# Altium project dashcam_cpu_v2.0.PrjPcb (part 10 of 13)

## Sheet wifi_ble.SchDoc
size A2; SheetNumber: 12; SheetTotal: 15
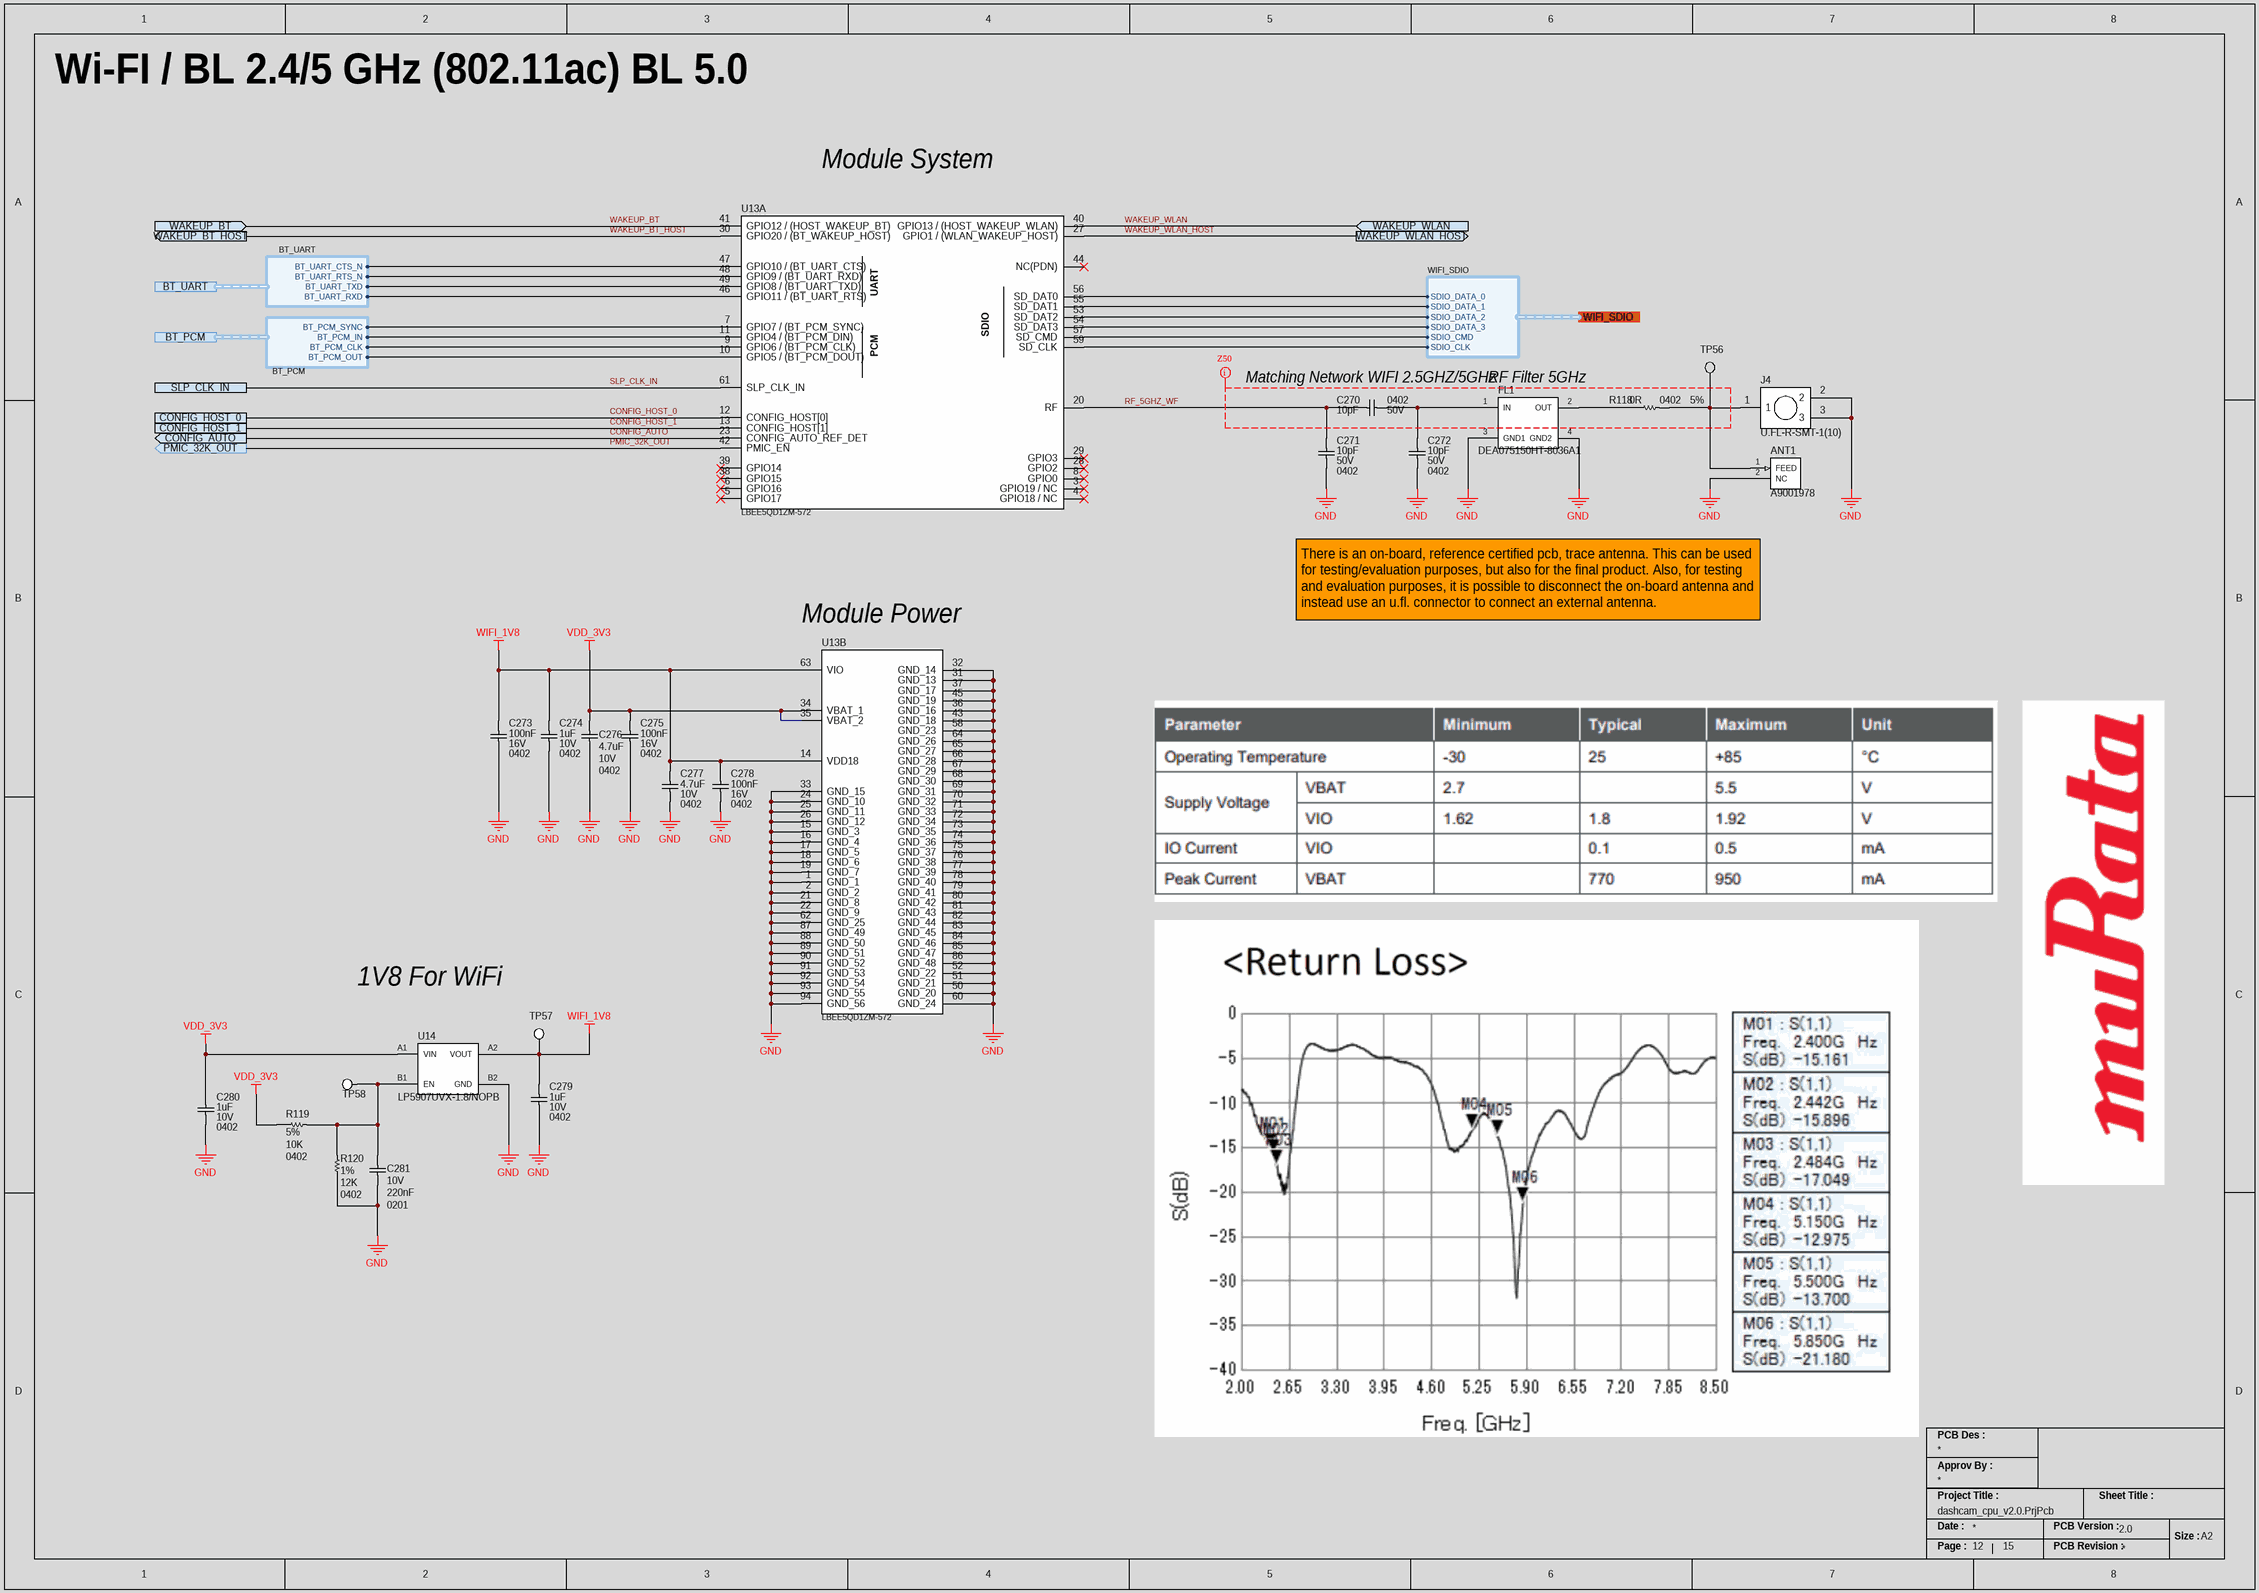
[diagram p14: wifi_ble.SchDoc]

### Parts
ANT1  A9001978  [ANTENNA_CHIP_ANTC1006X50N]
C270  Case/Package: 0402  Voltage Rating: 50V  Capacitance: 10pF  [CAP_0402_CAPC1005X05N]  (hidden comment: GJM1555C1H100FB01D)
C271  Case/Package: 0402  Voltage Rating: 50V  Capacitance: 10pF  [CAP_0402_CAPC1005X05N]  (hidden comment: GJM1555C1H100FB01D)
C272  Case/Package: 0402  Voltage Rating: 50V  Capacitance: 10pF  [CAP_0402_CAPC1005X05N]  (hidden comment: GJM1555C1H100FB01D)
C273  Voltage Rating: 16V  Capacitance: 100nF  Case/Package: 0402  [CAP_0402_CAPC1005X05N]  (hidden comment: CL05B104KO5NNNC)
C274  Voltage Rating: 10V  Capacitance: 1uF  Case/Package: 0402  [CAP_0402_CAPC1005X05N]  (hidden comment: GRM155C81A105KA12D)
C275  Voltage Rating: 16V  Capacitance: 100nF  Case/Package: 0402  [CAP_0402_CAPC1005X05N]  (hidden comment: CL05B104KO5NNNC)
C276  Capacitance: 4.7uF  Voltage Rating: 10V  Case/Package: 0402  [CAP_0402_CAPC1005X05N]  (hidden comment: CL05A475KP5NRNC)
C277  Capacitance: 4.7uF  Voltage Rating: 10V  Case/Package: 0402  [CAP_0402_CAPC1005X05N]  (hidden comment: CL05A475KP5NRNC)
C278  Voltage Rating: 16V  Capacitance: 100nF  Case/Package: 0402  [CAP_0402_CAPC1005X05N]  (hidden comment: CL05B104KO5NNNC)
C279  Voltage Rating: 10V  Capacitance: 1uF  Case/Package: 0402  [CAP_0402_CAPC1005X05N]  (hidden comment: GRM155C81A105KA12D)
C280  Voltage Rating: 10V  Capacitance: 1uF  Case/Package: 0402  [CAP_0402_CAPC1005X05N]  (hidden comment: GRM155C81A105KA12D)
C281  Voltage Rating (DC): 10V  Capacitance: 220nF  Case/Package: 0201  [CAP_0201_CAPC0603X03N]  (hidden comment: LMK063BJ224MP-F)
FL1  DEA075150HT-8036A1  [RF_FILTER_HP_DEA075150HT8036A1]
J4  U.FL-R-SMT-1(10)  [CONN_UFL_U.FL-R-SMT-1(10)]
R118  Case Code (Imperial): 0402  Tolerance: 5%  Resistance: 0R  [RES_0402_RESC1005X04N]  (hidden comment: ERJ-2GE0R00X)
R119  Tolerance: 5%  Resistance: 10K  Case/Package: 0402  [RES_0402_RESC1005X04N]  (hidden comment: ERJ-2GEJ103X)
R120  Tolerance: 1%  Resistance: 12K  Case/Package: 0402  [RES_0402_RESC1005X04N]  (hidden comment: ERJ-2RKF1202X)
TP56  NO COMPONENT  [TP_PAD_0.5MM_SMD_ROUND]  (value not drawn)  (no BOM)
TP57  NO COMPONENT  [TP_PAD_0.8MM_SMD_ROUND]  (value not drawn)  (no BOM)
TP58  NO COMPONENT  [TP_PAD_0.8MM_SMD_ROUND]  (value not drawn)  (no BOM)
U13  LBEE5QD1ZM-572  [IC_WIFI_BLE_LBEE5QD1ZM572]  (parts A,B of 2)
U14  LP5907UVX-1.8/NOPB  [IC_REG_LDO_BGA4C35P2X2_71X71X40]

### Ports
BT_PCM (harness BT_PCM), BT_UART (harness BT_UART), CONFIG_AUTO (out), CONFIG_HOST_0, CONFIG_HOST_1, PMIC_32K_OUT (out), SLP_CLK_IN, WAKEUP_BT (in), WAKEUP_BT_HOST (out), WAKEUP_WLAN (in), WAKEUP_WLAN_HOST (out), WIFI_SDIO (harness WIFI_SDIO)

### Harnesses
WIFI_SDIO: SDIO_CLK, SDIO_CMD, SDIO_DATA_0, SDIO_DATA_1, SDIO_DATA_2, SDIO_DATA_3
BT_UART: BT_UART_CTS_N, BT_UART_RTS_N, BT_UART_TXD, BT_UART_RXD
BT_PCM: BT_PCM_SYNC, BT_PCM_IN, BT_PCM_CLK, BT_PCM_OUT

### Nets
GND: ANT1.2(NC) C271.1 C272.1 C273.1 C274.1 C275.1 C276.1 C277.1 C278.1 C279.1 C280.1 C281.1 FL1.3(GND1) FL1.4(GND2) J4.2 J4.3 R120.1 U13.1(GND_1) U13.2(GND_2) U13.15(GND_3) U13.16(GND_4) U13.17(GND_5) U13.18(GND_6) U13.19(GND_7) U13.21(GND_8) U13.22(GND_9) U13.24(GND_10) U13.25(GND_11) U13.26(GND_12) U13.31(GND_13) U13.32(GND_14) U13.33(GND_15) U13.36(GND_16) U13.37(GND_17) U13.43(GND_18) U13.45(GND_19) U13.50(GND_20) U13.51(GND_21) U13.52(GND_22) U13.58(GND_23) U13.60(GND_24) U13.62(GND_25) U13.64(GND_26) U13.65(GND_27) U13.66(GND_28) U13.67(GND_29) U13.68(GND_30) U13.69(GND_31) U13.70(GND_32) U13.71(GND_33) U13.72(GND_34) U13.73(GND_35) U13.74(GND_36) U13.75(GND_37) U13.76(GND_38) U13.77(GND_39) U13.78(GND_40) U13.79(GND_41) U13.80(GND_42) U13.81(GND_43) U13.82(GND_44) U13.83(GND_45) U13.84(GND_46) U13.85(GND_47) U13.86(GND_48) U13.87(GND_49) U13.88(GND_50) U13.89(GND_51) U13.90(GND_52) U13.91(GND_53) U13.92(GND_54) U13.93(GND_55) U13.94(GND_56) U14.B2(GND)
VDD_3V3: C275.2 C276.2 C280.2 R119.1 U13.34(VBAT_1) U13.35(VBAT_2) U14.A1(VIN)
WIFI_1V8: C273.2 C274.2 C277.2 C278.2 C279.2 TP57.1 U13.14(VDD18) U13.63(VIO) U14.A2(VOUT)
BT_PCM_CLK: U13.9(GPIO6_/_(BT_PCM_CLK)) ; port BT_PCM.BT_PCM_CLK
BT_PCM_IN: U13.11(GPIO4_/_(BT_PCM_DIN)) ; port BT_PCM.BT_PCM_IN
BT_PCM_OUT: U13.10(GPIO5_/_(BT_PCM_DOUT)) ; port BT_PCM.BT_PCM_OUT
BT_PCM_SYNC: U13.7(GPIO7_/_(BT_PCM_SYNC)) ; port BT_PCM.BT_PCM_SYNC
BT_UART_CTS_N: U13.47(GPIO10_/_(BT_UART_CTS)) ; port BT_UART.BT_UART_CTS_N
BT_UART_RTS_N: U13.48(GPIO9_/_(BT_UART_RXD)) ; port BT_UART.BT_UART_RTS_N
BT_UART_RXD: U13.46(GPIO11_/_(BT_UART_RTS)) ; port BT_UART.BT_UART_RXD
BT_UART_TXD: U13.49(GPIO8_/_(BT_UART_TXD)) ; port BT_UART.BT_UART_TXD
CONFIG_AUTO: U13.23(CONFIG_AUTO_REF_DET) ; port CONFIG_AUTO
CONFIG_HOST_0: U13.12(CONFIG_HOST[0]) ; port CONFIG_HOST_0
CONFIG_HOST_1: U13.13(CONFIG_HOST[1]) ; port CONFIG_HOST_1
PMIC_32K_OUT: U13.42(PMIC_EN) ; port PMIC_32K_OUT
RF_5GHZ_WF: C270.1 C271.2 U13.20(RF)
SDIO_CLK: U13.59(SD_CLK) ; port WIFI_SDIO.SDIO_CLK
SDIO_CMD: U13.57(SD_CMD) ; port WIFI_SDIO.SDIO_CMD
SDIO_DATA_0: U13.56(SD_DAT0) ; port WIFI_SDIO.SDIO_DATA_0
SDIO_DATA_1: U13.55(SD_DAT1) ; port WIFI_SDIO.SDIO_DATA_1
SDIO_DATA_2: U13.53(SD_DAT2) ; port WIFI_SDIO.SDIO_DATA_2
SDIO_DATA_3: U13.54(SD_DAT3) ; port WIFI_SDIO.SDIO_DATA_3
SLP_CLK_IN: U13.61(SLP_CLK_IN) ; port SLP_CLK_IN
WAKEUP_BT: U13.41(GPIO12_/_(HOST_WAKEUP_BT)) ; port WAKEUP_BT
WAKEUP_BT_HOST: U13.30(GPIO20_/_(BT_WAKEUP_HOST)) ; port WAKEUP_BT_HOST
WAKEUP_WLAN: U13.40(GPIO13_/_(HOST_WAKEUP_WLAN)) ; port WAKEUP_WLAN
WAKEUP_WLAN_HOST: U13.27(GPIO1_/_(WLAN_WAKEUP_HOST)) ; port WAKEUP_WLAN_HOST
NetANT1_1: ANT1.1(FEED) J4.1 R118.2 TP56.1
NetC270_2: C270.2 C272.2 FL1.1(IN)
NetC281_2: C281.2 R119.2 R120.2 TP58.1 U14.B1(EN)
NetFL1_2: FL1.2(OUT) R118.1

Not connected (* = marked no-connect by the designer): U13 3(GPIO19_/_NC)* 4(GPIO18_/_NC)* 5(GPIO17)* 6(GPIO16)* 8(GPIO0)* 28(GPIO2)* 29(GPIO3)* 38(GPIO15)* 39(GPIO14)* 44(NC(PDN))*

### Layout directives
net class Z50: (no net found under the mark)

### Notes on the sheet
- Wi-FI / BL 2.4/5 GHz (802.11ac) BL 5.0
- Module System
- Matching Network WIFI 2.5GHZ/5GHz
- (near FL1) RF Filter 5GHz
- Module Power
- There is an on-board, reference certified pcb, trace antenna. This can be used for testing/evaluation purposes, but also for the final product. Also, for testing and evaluation purposes, it is possible to disconnect the on-board antenna and instead use an u.fl. connector to connect an external antenna.
- 1V8 For WiFi
- PCB Des :
- Approv By :
- Project Title :
- Sheet Title :
- Date :
- Page :
- PCB Version :
- PCB Revision :
- Size :
- A2
- (in symbol IC_WIFI_BLE_LBEE5QD1ZM-572, part A) UART; SDIO; PCM

### Library data of the parts
ANT1 = ANT_CHIP_2.5GHz_5GHz_A9001978: Automotive Ultra-small Uwb Or Bl; Manufacturer: Kyocera AVX; Supplier 1: Digikey; Manufacturer Part Number: A9001978; RoHS: No; Category: Uncategorized; Stock 1: 3990; Pricing 1: 1=1.53, 10=1.367, 25=1.2976, 100=1.066, 250=0.99652, 500=0.88064, 1000=0.69525, 2500=0.6489 (USD); Supplier Part Number 1: 478-A9001978CT-ND
C270-C272 = CAP_10PF_50V_NP0_0402: Multilayer Ceramic Capacitor, 10 pF, 50 V, ± 1%, C0G (NP0), 0402 [1005 Metric]; Manufacturer: Murata; Material: 4241ConductorMaterial; Temperature Coefficient: 30ppm/°C; Supplier 1: Digikey; Manufacturer Part Number: GJM1555C1H100FB01D; RoHS: Yes; Category: Ceramic Capacitors; Stock 1: 104534; Pricing 1: 1=0.17, 10=0.113, 50=0.0676, 100=0.0532, 500=0.03926, 1000=0.03251, 2500=0.03026, 5000=0.02768 (USD); Mount: Surface Mount; Case Code (Imperial): 0402; Case Code (Metric): 1005; Weight: 2.3E-05oz; Min Operating Temperature: -55°C; Max Operating Temperature: 125°C; Packaging: Tape and Reel; Tolerance: 1%; Voltage Rating (DC): 50V; Dielectric: C0G; Termination: SMD/SMT; Voltage: 50V; Series: GJM; Construction: Flat; Length: 1mm; Width: 0.02inch; Height: 0.5mm; Thickness: 0.022inch; Depth: 0.5mm; Radiation Hardening: No; Reach SVHC Compliant: No; Lead Free: Lead Free; RoHS Compliant: Yes; ComponentLink1URL: https://datasheet.ciiva.com/11607/c02e-11607390.pdf?src-supplier=Avnet; ComponentLink1Description: https://datasheet.ciiva.com/11607/c02e-11607390.pdf?src-supplier=Avnet; Supplier Part Number 1: 490-11189-1-ND
C273 C275 C278 = CAP_100NF_16V_X7R_0402: Multilayer Ceramic Capacitor, 0.1 uF, 16 V, ± 10%, X7R, 0402 [1005 Metric]; Manufacturer: Samsung; Supplier 1: Digi-Key; Manufacturer Part Number: CL05B104KO5NNNC; RoHS: Yes; Category: Ceramic Capacitors; Stock 1: 11081064; Pricing 1: 1=0.1, 10=0.024, 50=0.013, 100=0.0105, 500=0.00752, 1000=0.00592, 2500=0.00538, 5000=0.00495 (USD); Mount: Surface Mount; Case Code (Metric): 1005; Case Code (Imperial): 0402; Material: Ceramic; Min Operating Temperature: -55°C; Max Operating Temperature: 125°C; Tolerance: 10%; Package Quantity: 1; Packaging: Tape and Reel; Dielectric: X7R; Series: CL; Voltage: 16V; Voltage Rating (DC): 16V; Construction: Flat; Length: 1mm; Width: 0.02inch; Height: 0.5mm; Thickness: 0.022inch; Depth: 0.5mm; Radiation Hardening: No; RoHS Compliant: Yes; Lead Free: Lead Free; ComponentLink1URL: https://datasheet.ciiva.com/26920/getdatasheetpartid-359683-26920169.pdf?src-supplier=Verical; ComponentLink1Description: https://datasheet.ciiva.com/26920/getdatasheetpartid-359683-26920169.pdf?src-supplier=Verical; ComponentLink2URL: https://datasheet.ciiva.com/29198/458718-da-01-en-vs-kondensator-0402-29198423.pdf?src-supplier=Conrad; ComponentLink2Description: https://datasheet.ciiva.com/29198/458718-da-01-en-vs-kondensator-0402-29198423.pdf?src-supplier=Conrad; ComponentLink3URL: https://datasheet.ciiva.com/16208/cl05b104kq5nnnc-16208343.pdf?src-supplier=Future+Electronics; ComponentLink3Description: https://datasheet.ciiva.com/16208/cl05b104kq5nnnc-16208343.pdf?src-supplier=Future+Electronics; ComponentLink4URL: https://datasheet.ciiva.com/26309/mlcc-catalogdownload2013-eng-26309003.pdf?src-supplier=Distrelec; ComponentLink4Description: https://datasheet.ciiva.com/26309/mlcc-catalogdownload2013-eng-26309003.pdf?src-supplier=Distrelec; Supplier Part Number 1: 1276-1001-6-ND
C274 C279 C280 = CAP_1UF_10V_X6S_0402: 0402 10 V 1 uF ±10% Tolerance X6S Multilayer Ceramic Capacitor; Manufacturer: Murata; Supplier 1: Digikey; Manufacturer Part Number: GRM155C81A105KA12D; RoHS: Yes; Category: Ceramic Capacitors; Stock 1: 2486564; Pricing 1: 1=0.1, 10=0.045, 50=0.026, 100=0.0202, 500=0.01518, 1000=0.01192, 2500=0.01084, 5000=0.00997 (USD); Mount: Surface Mount; Case Code (Metric): 1005; Material: Ceramic; Case Code (Imperial): 0402; Weight: 0.000212oz; Min Operating Temperature: -55°C; Max Operating Temperature: 105°C; Dielectric: X6S; Packaging: Tape and Reel; Termination: SMD/SMT; Voltage Rating (DC): 10V; Package Quantity: 10000; Series: GRM; Length: 1mm; Width: 0.5mm; Height: 0.5mm; Thickness: 0.022inch; Lead Free: Lead Free; RoHS Compliant: Yes; ComponentLink1URL: http://www.mouser.com/ds/2/281/c02e-2905.pdf?src-supplier=Mouser; ComponentLink1Description: http://www.mouser.com/ds/2/281/c02e-2905.pdf?src-supplier=Mouser; ComponentLink2URL: https://datasheet.octopart.com/GRM155C81A105KA12D-Murata-datasheet-22122223.pdf?src-supplier=Future+Electronics; ComponentLink2Description: https://datasheet.octopart.com/GRM155C81A105KA12D-Murata-datasheet-22122223.pdf?src-supplier=Future+Electronics; ComponentLink3URL: https://datasheet.octopart.com/GRM155C81A105KA12D-Murata-datasheet-149522926.pdf?src-supplier=Newark; ComponentLink3Description: https://datasheet.octopart.com/GRM155C81A105KA12D-Murata-datasheet-149522926.pdf?src-supplier=Newark; ComponentLink4URL: http://search.murata.co.jp/Ceramy/image/img/A01X/G101/ENG/GRM155C81A105KA12-01.pdf?src-supplier=Digikey; ComponentLink4Description: http://search.murata.co.jp/Ceramy/image/img/A01X/G101/ENG/GRM155C81A105KA12-01.pdf?src-supplier=Digikey; ComponentLink5URL: http://search.murata.co.jp/Ceramy/image/img/A01X/partnumbering_e_01.pdf?src-supplier=Digikey; ComponentLink5Description: http://search.murata.co.jp/Ceramy/image/img/A01X/partnumbering_e_01.pdf?src-supplier=Digikey; ComponentLink6URL: https://datasheet.octopart.com/GRM155C81A105KA12D-Murata-datasheet-165579666.pdf?src-supplier=TME; ComponentLink6Description: https://datasheet.octopart.com/GRM155C81A105KA12D-Murata-datasheet-165579666.pdf?src-supplier=TME; Supplier Part Number 1: 490-12699-6-ND; Tolerance: 10%
C276 C277 = CAP_4.7UF_10V_X5R_0402: as C252 on sheet emmc_flash; Supplier 1: Digikey; Manufacturer Part Number: CL05A475KP5NRNC; RoHS: Yes; Category: Ceramic Capacitors; Stock 1: 748042; Pricing 1: 1=0.28, 10=0.184, 50=0.129, 100=0.1042, 500=0.0774, 1000=0.06772, 2500=0.0645, 5000=0.05966 (USD); Mount: Surface Mount; Case Code (Metric): 1005; Case Code (Imperial): 0402; Material: Ceramic; Min Operating Temperature: -55°C; Max Operating Temperature: 85°C; Tolerance: 10%; Packaging: Tape and Reel; Package Quantity: 1; Dielectric: X5R; Series: CL; Construction: Flat; Length: 1mm; Width: 0.02inch; Height: 0.5mm; Thickness: 0.022inch; Depth: 0.5mm; Radiation Hardening: No; RoHS Compliant: Yes; Lead Free: Lead Free; ComponentLink1URL: https://datasheet.ciiva.com/25724/cl05a475kp5nrnc-25724404.pdf?src-supplier=Digikey; ComponentLink1Description: https://datasheet.ciiva.com/25724/cl05a475kp5nrnc-25724404.pdf?src-supplier=Digikey; ComponentLink2URL: https://datasheet.ciiva.com/29198/458873-da-01-en-vs-kondensator-0402-29198304.pdf?src-supplier=Conrad; ComponentLink2Description: https://datasheet.ciiva.com/29198/458873-da-01-en-vs-kondensator-0402-29198304.pdf?src-supplier=Conrad; Supplier Part Number 1: 1276-1480-1-ND
C281 = CAP_0.22UF_10V_X5R_0201: as C253 on sheet emmc_flash; Supplier 1: Digikey; Manufacturer Part Number: LMK063BJ224MP-F; RoHS: Yes; Category: Ceramic Capacitors; Stock 1: 6053224; Pricing 1: 1=0.12, 10=0.08, 50=0.0478, 100=0.0375, 500=0.02772, 1000=0.02295, 2500=0.02136, 5000=0.01954 (USD); Mount: Surface Mount; Case Code (Metric): 0603; Case Code (Imperial): 0201; Min Operating Temperature: -55°C; Max Operating Temperature: 85°C; Voltage Rating: 10V; Packaging: Tape and Reel; Package Quantity: 15000; Dielectric: X5R; Termination: SMD/SMT; Voltage: 10V; Series: M; Construction: Flat; Length: 0.6mm; Width: 0.3mm; Height: 0.3mm; Depth: 0.3mm; Radiation Hardening: No; Halogen Free: Halogen Free; RoHS Compliant: Yes; Reach SVHC Compliant: Unknown; ComponentLink1URL: https://datasheet.ciiva.com/134/lmk063bj224mp-f-ss-134995.pdf?src-supplier=Digikey; ComponentLink1Description: https://datasheet.ciiva.com/134/lmk063bj224mp-f-ss-134995.pdf?src-supplier=Digikey; ComponentLink2URL: https://datasheet.ciiva.com/11464/lmk063bj224mp-f-ss-11464053.pdf?src-supplier=Avnet; ComponentLink2Description: https://datasheet.ciiva.com/11464/lmk063bj224mp-f-ss-11464053.pdf?src-supplier=Avnet; ComponentLink3URL: https://datasheet.ciiva.com/15921/1589lmk063bj224mp-f-15921250.pdf?src-supplier=Onlinecomponents.com; ComponentLink3Description: https://datasheet.ciiva.com/15921/1589lmk063bj224mp-f-15921250.pdf?src-supplier=Onlinecomponents.com; ComponentLink4URL: https://datasheet.ciiva.com/26872/getdatasheetpartid-639019-26872592.pdf?src-supplier=Verical; ComponentLink4Description: https://datasheet.ciiva.com/26872/getdatasheetpartid-639019-26872592.pdf?src-supplier=Verical; ComponentLink5URL: https://datasheet.ciiva.com/30243/100lmk063bj224mp-f-30243150.pdf?src-supplier=Onlinecomponents.com; ComponentLink5Description: https://datasheet.ciiva.com/30243/100lmk063bj224mp-f-30243150.pdf?src-supplier=Onlinecomponents.com; ComponentLink6URL: https://datasheet.ciiva.com/28645/746258-28645141.pdf?src-supplier=Element14; ComponentLink6Description: https://datasheet.ciiva.com/28645/746258-28645141.pdf?src-supplier=Element14; ComponentLink7URL: https://datasheet.ciiva.com/5422/mlcc-all-e-541559-5422365.pdf?src-supplier=Mouser; ComponentLink7Description: https://datasheet.ciiva.com/5422/mlcc-all-e-541559-5422365.pdf?src-supplier=Mouser; Supplier Part Number 1: 587-2483-1-ND
FL1 = RF_FILTER_HIGH_PASS_DEA075150HT-8036A1: RF Filter High Pass 5150MHz 2400MHz to 2500MHz 0.5dB 50Ohm SMD 4Pin 0202 T/R; Manufacturer: TDK; Frequency: 5GHz; Supplier 1: Digikey; Manufacturer Part Number: DEA075150HT-8036A1; RoHS: No; Stock 1: 5961; Pricing 1: 1=0.24, 10=0.23, 25=0.2228, 50=0.2154, 100=0.2042, 250=0.1708, 500=0.13256, 1000=0.12625, 5000=0.11139 (USD); Mount: Surface Mount; Case Code (Imperial): 0202; Case Code (Metric): 0505; Packaging: Cut Tape; Insertion Loss: 0.5dB; Series: DEA; ComponentLink1URL: https://media.digikey.com/pdf/Data%20Sheets/TDK%20PDFs/DEA075150HT-8036A1_Rev1.0.pdf?src-supplier=Digikey; ComponentLink1Description: https://media.digikey.com/pdf/Data%20Sheets/TDK%20PDFs/DEA075150HT-8036A1_Rev1.0.pdf?src-supplier=Digikey; Supplier Part Number 1: 445-175384-1-ND
J4 = CONN_UFL_RF_5OR_U.FL-R-SMT-1(10): RF Connector, 1 Contact(s), Male, Board Mount, Surface Mount Terminal, Receptacle; Manufacturer: Hirose; Body Material: Bronze; Body Plating: Silver; Dielectric Material: Polymer; Center Contact Plating: Gold; Impedance: 50R; Connector Type: Receptacle,Male Pin; Max Frequency: 6GHz; Number of Ports: 1; Mating Cycles: 30; Insulation Resistance: 500MR; Supplier 1: Digikey; Manufacturer Part Number: U.FL-R-SMT-1(10); RoHS: Yes; Category: RF / Coaxial Connectors; Stock 1: 174716; Pricing 1: 1=1.26, 10=1.064, 25=1.0208, 50=0.9988, 100=0.9555, 250=0.8686, 500=0.78174, 1000=0.69488 (USD); Mount: Surface Mount; Contact Material: Brass; Housing Color: Beige; Weight: 0.001764oz; Min Operating Temperature: -40°C; Max Operating Temperature: 90°C; Packaging: Tape and Reel; Package Quantity: 2500; Fastening Type: SNAP-ON; Termination: Solder; Series: U.FL; Orientation: Straight; RoHS Compliant: Yes; Lead Free: 5697LeadFree; ComponentLink1URL: https://datasheet.ciiva.com/11762/0900766b8105243f-11762474.pdf?src-supplier=Rs; ComponentLink1Description: https://datasheet.ciiva.com/11762/0900766b8105243f-11762474.pdf?src-supplier=Rs; ComponentLink2URL: https://datasheet.ciiva.com/7651/91524-7651914.pdf?src-supplier=Element14; ComponentLink2Description: https://datasheet.ciiva.com/7651/91524-7651914.pdf?src-supplier=Element14; ComponentLink3URL: https://datasheet.ciiva.com/7651/91524-7651915.pdf?src-supplier=Element14; ComponentLink3Description: https://datasheet.ciiva.com/7651/91524-7651915.pdf?src-supplier=Element14; Supplier Part Number 1: H11891DKR-ND
R118 = RES_0R_5%_100mW_0402: as R106 on sheet usb_debug; Supplier 1: Mouser; Manufacturer Part Number: ERJ-2GE0R00X; RoHS: Yes; Category: Chip SMD Resistors; Stock 1: 10989354; Pricing 1: 1=0.1, 10=0.013, 50=0.013, 100=0.006, 1000=0.004, 2500=0.003, 10000=0.003 (USD); Mount: Surface Mount; Case/Package: 0402; Contact Plating: Tin; Case Code (Metric): 1005; Size Code: 0402; Min Operating Temperature: -55°C; Max Operating Temperature: 155°C; Resistor Type: Thick Film; Packaging: Cut Tape; Package Quantity: 10000; Number of Terminations: 2; Termination: SMD/SMT; Max Power Dissipation: 100mW; Voltage Rating (DC): 50V; Features: Automotive AEC-Q200; Series: ERJ; Construction: Rectangular; Technology: THICK FILM; Length: 1mm; Width: 0.5mm; Height: 0.35mm; Depth: 0.5mm; Ratings: AEC-Q200; Radiation Hardening: No; Reach SVHC Compliant: No; Military Standard: Not; Lead Free: Lead Free; RoHS Compliant: Yes; ComponentLink1URL: https://datasheet.ciiva.com/11821/0900766b80f806dd-11821176.pdf?src-supplier=Rs; ComponentLink1Description: https://datasheet.ciiva.com/11821/0900766b80f806dd-11821176.pdf?src-supplier=Rs; ComponentLink2URL: https://datasheet.ciiva.com/43460/1678796-43460347.pdf?src-supplier=Farnell; ComponentLink2Description: https://datasheet.ciiva.com/43460/1678796-43460347.pdf?src-supplier=Farnell; ComponentLink3URL: https://datasheet.ciiva.com/46389/1678796-46389518.pdf?src-supplier=Element14; ComponentLink3Description: https://datasheet.ciiva.com/46389/1678796-46389518.pdf?src-supplier=Element14; ComponentLink4URL: https://datasheet.ciiva.com/5959/1678796-5959692.pdf?src-supplier=Farnell; ComponentLink4Description: https://datasheet.ciiva.com/5959/1678796-5959692.pdf?src-supplier=Farnell; ComponentLink5URL: https://datasheet.ciiva.com/28695/1678796-28695758.pdf?src-supplier=Element14; ComponentLink5Description: https://datasheet.ciiva.com/28695/1678796-28695758.pdf?src-supplier=Element14; ComponentLink6URL: https://datasheet.ciiva.com/16783/70260739-16783734.pdf?src-supplier=Allied+Electronics; ComponentLink6Description: https://datasheet.ciiva.com/16783/70260739-16783734.pdf?src-supplier=Allied+Electronics; ComponentLink7URL: https://datasheet.ciiva.com/16778/70260739-16778335.pdf?src-supplier=Allied+Electronics; ComponentLink7Description: https://datasheet.ciiva.com/16778/70260739-16778335.pdf?src-supplier=Allied+Electronics; ComponentLink8URL: https://datasheet.ciiva.com/48531/aoa0000ce1-48531077.pdf?src-supplier=Avnet; ComponentLink8Description: https://datasheet.ciiva.com/48531/aoa0000ce1-48531077.pdf?src-supplier=Avnet; ComponentLink9URL: https://datasheet.ciiva.com/30097/4aoa0000ce1-30097116.pdf?src-supplier=Onlinecomponents.com; ComponentLink9Description: https://datasheet.ciiva.com/30097/4aoa0000ce1-30097116.pdf?src-supplier=Onlinecomponents.com; Supplier Part Number 1: 667-ERJ-2GE0R00X
R119 = RES_10K_5%_100mW_0402: Res Thick Film 0402 10K Ohm 5% 1/10W ±200ppm/°C Molded SMD Punched Carrier T/R; Manufacturer: Panasonic; Power Rating: 100mW; Voltage Rating: 50V; Supplier 1: Digi-Key; Manufacturer Part Number: ERJ-2GEJ103X; RoHS: Yes; Category: Chip SMD Resistors; Stock 1: 4696986; Pricing 1: 1=0.1, 10=0.021, 50=0.0132, 100=0.011, 500=0.00744, 1000=0.00639, 5000=0.00464 (USD); Mount: Surface Mount; Contact Plating: Tin; Case Code (Metric): 1005; Case Code (Imperial): 0402; Size Code: 0402; Min Operating Temperature: -55°C; Max Operating Temperature: 155°C; Temperature Coefficient: 200ppm/°C; Packaging: Cut Tape; Resistor Type: Thick Film; Package Quantity: 10000; Number of Terminations: 2; Termination: SMD/SMT; Max Power Dissipation: 100mW; Features: Automotive AEC-Q200; Series: ERJ; Resistance Tolerance: 5%; Technology: THICK FILM; Voltage Rating (DC): 50V; Length: 1mm; Width: 0.5mm; Height: 0.35mm; Depth: 0.5mm; Ratings: AEC-Q200; Radiation Hardening: No; Reach SVHC Compliant: No; RoHS Compliant: Yes; Lead Free: 5697LeadFree; ComponentLink1URL: https://datasheet.ciiva.com/27055/1935721-27055112.pdf?src-supplier=Jameco; ComponentLink1Description: https://datasheet.ciiva.com/27055/1935721-27055112.pdf?src-supplier=Jameco; ComponentLink2URL: https://datasheet.ciiva.com/11821/0900766b80f806dd-11821170.pdf?src-supplier=Rs; ComponentLink2Description: https://datasheet.ciiva.com/11821/0900766b80f806dd-11821170.pdf?src-supplier=Rs; ComponentLink3URL: https://datasheet.ciiva.com/43460/1678796-43460391.pdf?src-supplier=Farnell; ComponentLink3Description: https://datasheet.ciiva.com/43460/1678796-43460391.pdf?src-supplier=Farnell; ComponentLink4URL: https://datasheet.ciiva.com/22785/1678796-22785949.pdf?src-supplier=Farnell; ComponentLink4Description: https://datasheet.ciiva.com/22785/1678796-22785949.pdf?src-supplier=Farnell; ComponentLink5URL: https://datasheet.ciiva.com/46371/1678796-46371910.pdf?src-supplier=Element14; ComponentLink5Description: https://datasheet.ciiva.com/46371/1678796-46371910.pdf?src-supplier=Element14; ComponentLink6URL: https://datasheet.ciiva.com/28514/1678796-28514154.pdf?src-supplier=Element14; ComponentLink6Description: https://datasheet.ciiva.com/28514/1678796-28514154.pdf?src-supplier=Element14; ComponentLink7URL: https://datasheet.ciiva.com/24070/aoa0000ce1-37422-24070679.pdf?src-supplier=Mouser; ComponentLink7Description: https://datasheet.ciiva.com/24070/aoa0000ce1-37422-24070679.pdf?src-supplier=Mouser; ComponentLink8URL: https://datasheet.ciiva.com/16767/70260739-16767130.pdf?src-supplier=Allied+Electronics; ComponentLink8Description: https://datasheet.ciiva.com/16767/70260739-16767130.pdf?src-supplier=Allied+Electronics; ComponentLink9URL: https://datasheet.ciiva.com/16774/70260739-16774504.pdf?src-supplier=Allied+Electronics; ComponentLink9Description: https://datasheet.ciiva.com/16774/70260739-16774504.pdf?src-supplier=Allied+Electronics; ComponentLink10URL: https://datasheet.ciiva.com/9194/aoa0000ce1-9194140.pdf?src-supplier=Avnet; ComponentLink10Description: https://datasheet.ciiva.com/9194/aoa0000ce1-9194140.pdf?src-supplier=Avnet; Supplier Part Number 1: P10KJCT-ND
R120 = RES_12K_1%_100mW_0402: Res Thick Film 0402 12K Ohm 1% 0.1W(1/10W) +/-100ppm/C Molded SMD Automotive Punched T/R; Manufacturer: Panasonic; Power Rating: 100mW; Voltage Rating: 50V; Temperature Coefficient: 100ppm/°C; Supplier 1: Mouser; Manufacturer Part Number: ERJ-2RKF1202X; RoHS: Yes; Category: Chip SMD Resistors; Stock 1: 301526; Pricing 1: 1=0.1, 10=0.017, 50=0.017, 100=0.008, 1000=0.006, 10000=0.003 (USD); Mount: Surface Mount; Number of Pins: 2; Case Code (Metric): 1005; Case Code (Imperial): 0402; Contact Plating: Tin; Size Code: 0402; Min Operating Temperature: -55°C; Max Operating Temperature: 155°C; Packaging: Tape and Reel; Package Quantity: 1; Resistor Type: Thick Film; Number of Terminations: 2; Termination: SMD/SMT; Max Power Dissipation: 100mW; Features: Automotive AEC-Q200; Series: ERJ; Resistance Tolerance: 1%; Construction: Rectangular; Technology: THICK FILM; Voltage Rating (DC): 50V; Length: 1mm; Width: 0.5mm; Height: 0.35mm; Depth: 0.5mm; Reach SVHC Compliant: No; Military Standard: Not; RoHS Compliant: Yes; Lead Free: 5697LeadFree; ComponentLink1URL: https://datasheet.ciiva.com/7944/aoa0000ce2-7944604.pdf?src-supplier=Element14; ComponentLink1Description: https://datasheet.ciiva.com/7944/aoa0000ce2-7944604.pdf?src-supplier=Element14; ComponentLink2URL: https://datasheet.ciiva.com/7944/426256-7944939.pdf?src-supplier=Element14; ComponentLink2Description: https://datasheet.ciiva.com/7944/426256-7944939.pdf?src-supplier=Element14; ComponentLink3URL: https://datasheet.ciiva.com/46373/1678782-46373164.pdf?src-supplier=Element14; ComponentLink3Description: https://datasheet.ciiva.com/46373/1678782-46373164.pdf?src-supplier=Element14; ComponentLink4URL: https://datasheet.ciiva.com/22673/1678782-22673676.pdf?src-supplier=Element14; ComponentLink4Description: https://datasheet.ciiva.com/22673/1678782-22673676.pdf?src-supplier=Element14; ComponentLink5URL: https://datasheet.ciiva.com/22687/1678782-22687405.pdf?src-supplier=Element14; ComponentLink5Description: https://datasheet.ciiva.com/22687/1678782-22687405.pdf?src-supplier=Element14; ComponentLink6URL: https://datasheet.ciiva.com/46373/1678782-46373165.pdf?src-supplier=Element14; ComponentLink6Description: https://datasheet.ciiva.com/46373/1678782-46373165.pdf?src-supplier=Element14; Supplier Part Number 1: 667-ERJ-2RKF1202X
TP56 = TP_PAD_SMD_SMALL: as TP37 on sheet emmc_flash
TP57 TP58 = TP_PAD_SMD_Round: as TP42-TP55 on sheet usb_debug
U13 = IC_WIFI_BLE_LBEE5QD1ZM-572: 2.4 to 5.825GHz Bluetooth WiFi 802.11a/b/g/-c, Bluetooth v5.1 Transceiver Module; Manufacturer_Name: Murata Electronics; Manufacturer: Murata; Datasheet Link: https://pl.mouser.com/datasheet/2/281/1/murata_type1zm-2006876.pdf; Height: 1.345mm; Manufacturer_Part_Number: LBEE5QD1ZM-572; Mouser Part Number: 81-LBEE5QD1ZM-572; Mouser Price/Stock: https://www.mouser.co.uk/ProductDetail/Murata-Electronics/LBEE5QD1ZM-572?qs=stqOd1AaK79ZX7AUUzAj%2FQ%3D%3D; Arrow Part Number: LBEE5QD1ZM-572; Arrow Price/Stock: https://www.arrow.com/en/products/lbee5qd1zm-572/murata-manufacturing?region=nac; Supplier: Mouser; Supplier Part Number: 81-LBEE5QD1ZM-572; Manufacturer Part Number: LBEE5QD1ZM-572; RoHS: No; Stock: 926; Pricing: 1=17.82, 10=16.11, 25=14.82, 50=14.48, 100=13.43, 250=12.74, 500=11.95, 1000=11.35, 10000=11.35 (USD)
U14 = IC_REG_LDO_1.8V_250mA_LP5907UVX-1.8/NOPB: Low Dropout Regulators(LDO) Positive Fixed 200mV @ 250mA 5.5V 1.8V 250mA DSBGA-4 RoHS; Manufacturer: Texas Instruments; Number of Outputs: 1; Min Input Voltage: 2.2V; Quiescent Current: 25uA; Accuracy: 2%; Dropout Voltage: 50mV; Max Supply Current: 425uA; Power Supply Rejection Ratio (PSRR): 60dB; Supplier 1: Digikey; Manufacturer Part Number: LP5907UVX-1.8/NOPB; RoHS: Yes; Category: Voltage Regulators - Linear; Stock 1: 47909; Pricing 1: 1=0.66, 10=0.564, 25=0.5268, 100=0.4214, 250=0.39128, 500=0.33108, 1000=0.25583 (USD); Mount: Surface Mount; Case/Package: SMD/SMT; Min Operating Temperature: -40°C; Max Operating Temperature: 125°C; Package Quantity: 3000; Packaging: Tape and Reel; Max Input Voltage: 5.5V; Max Output Current: 250mA; Output Voltage: 1.8V; Polarity: Positive; Output Type: Fixed; Series: -; Output Configuration: Positive; Number of Regulators: 1; Min Output Voltage: 1.8V; Output Current: 250mA; Radiation Hardening: No; Lead Free: Lead Free; RoHS Compliant: Yes; ComponentLink1URL: https://datasheet.ciiva.com/6597/lp5907-6597398.pdf?src-supplier=Digikey; ComponentLink1Description: https://datasheet.ciiva.com/6597/lp5907-6597398.pdf?src-supplier=Digikey; ComponentLink2URL: https://datasheet.ciiva.com/14278/lp5907-14278557.pdf?src-supplier=Avnet; ComponentLink2Description: https://datasheet.ciiva.com/14278/lp5907-14278557.pdf?src-supplier=Avnet; Supplier Part Number 1: 296-35634-1-ND